# Altium schematic sheet SdpSchem.SchDoc
size A
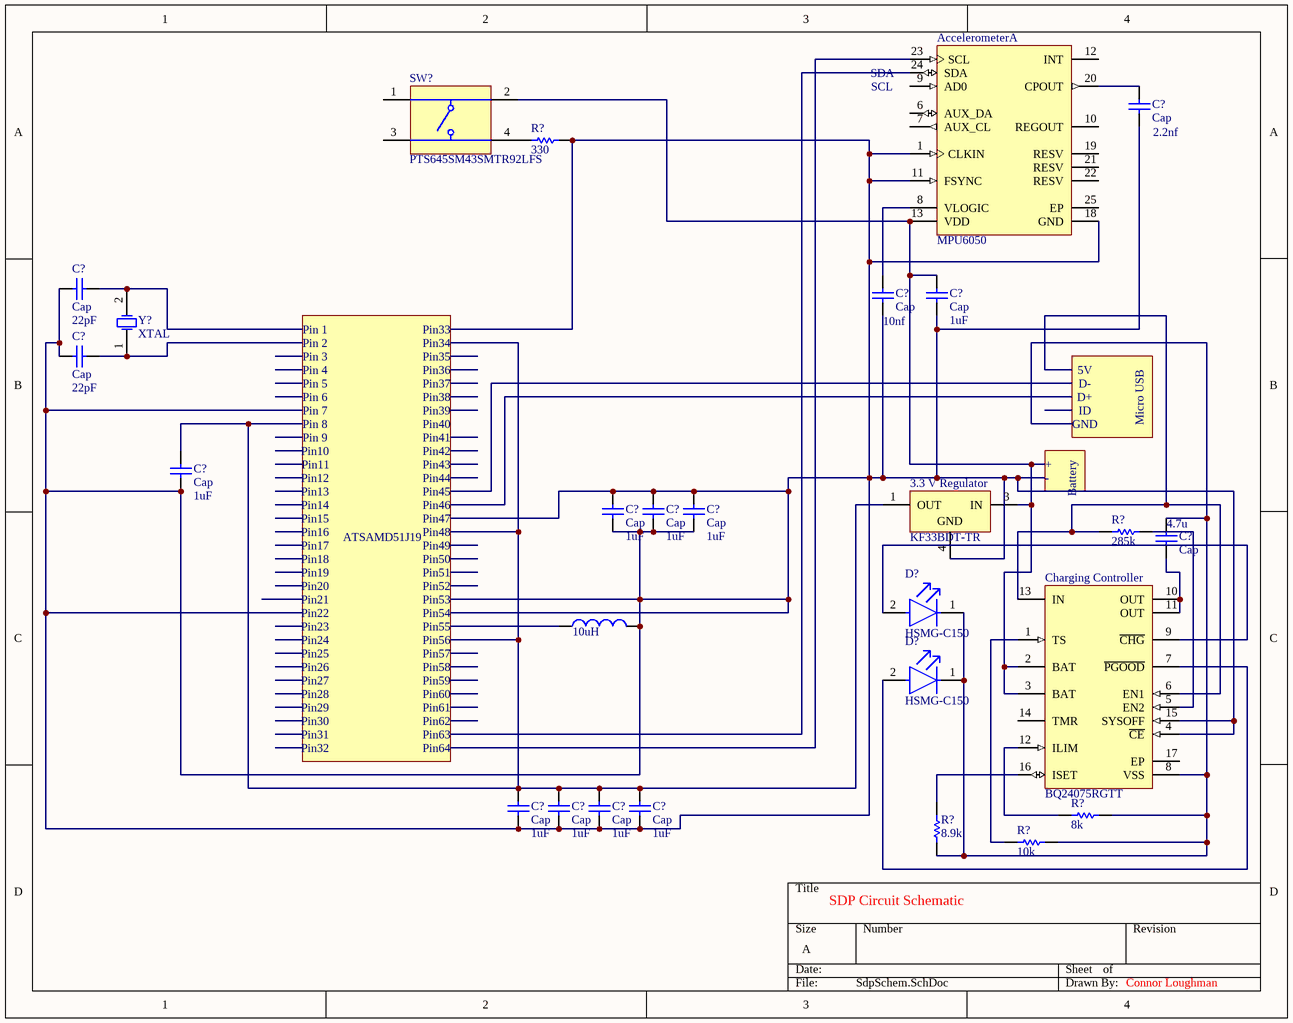
[diagram p0: SdpSchem.SchDoc]

## Parts
(Parts that share a designator on the sheet are numbered #1, #2 ... from top to bottom, then left to right.)
3.3_V_Regulator  KF33BDT-TR  [TO-252_L]
10uH  (no value)  [TDK-B82422A1103K100_V]
Accelerometer  MPU6050  [INSE-QFN-24_V]  (part A of 2)
C?#1  Cap  value 2.2nf  [RAD-0.3]
C?#2  Cap  value 22pF  [RAD-0.3]
C?#3  Cap  value 10nf  [RAD-0.3]
C?#4  Cap  value 1uF  [RAD-0.3]
C?#5  Cap  value 22pF  [RAD-0.3]
C?#6  Cap  value 1uF  [RAD-0.3]
C?#7  Cap  value 1uF  [RAD-0.3]
C?#8  Cap  value 1uF  [RAD-0.3]
C?#9  Cap  value 1uF  [RAD-0.3]
C?#10  Cap  value 4.7u  [RAD-0.3]
C?#11  Cap  value 1uF  [RAD-0.3]
C?#12  Cap  value 1uF  [RAD-0.3]
C?#13  Cap  value 1uF  [RAD-0.3]
C?#14  Cap  value 1uF  [RAD-0.3]
Charging_Controller  BQ24075RGTT  [RGT0016C_V]
D?#1  HSMG-C150  [FP-HSMG-C150-MFG]
D?#2  HSMG-C150  [FP-HSMG-C150-MFG]
R?#1  330  [AXIAL-0.3]
R?#2  285k  [AXIAL-0.3]
R?#3  8k  [AXIAL-0.3]
R?#4  10k  [AXIAL-0.3]
R?#5  8.9k  [AXIAL-0.3]
SW?  PTS645SM43SMTR92LFS  [ITT-PTS645S-4_V]
Y?  XTAL  [R38]

## Nets
Net3.3_V_Regulator_1: 3.3_V_Regulator.1(OUT) C?#6.2 C?#11.2 C?#12.2 C?#13.2 C?#14.2
Net3.3_V_Regulator_3: 3.3_V_Regulator.3(IN) Accelerometer.13(VDD) C?#4.2 Charging_Controller.2(BAT) Charging_Controller.3(BAT) SW?.2
Net3.3_V_Regulator_4: 3.3_V_Regulator.4(GND) 10uH.2 Accelerometer.1(CLKIN) Accelerometer.11(FSYNC) Accelerometer.18(GND) C?#1.1 C?#2.1 C?#3.1 C?#4.1 C?#5.1 C?#6.1 C?#7.1 C?#7.2 C?#8.1 C?#8.2 C?#9.1 C?#9.2 C?#11.1 C?#12.1 C?#13.1 C?#14.1 Charging_Controller.4(~{CE}) Charging_Controller.15(SYSOFF) R?#1.2
NetAccelerometer_8: Accelerometer.8(VLOGIC) C?#3.2
NetAccelerometer_20: Accelerometer.20(CPOUT) C?#1.2
NetC?#2_2: C?#2.2 Y?.2(OSC2)
NetC?#5_2: C?#5.2 Y?.1(OSC1)
NetC?#10_1: C?#10.1 Charging_Controller.10(OUT) Charging_Controller.11(OUT)
NetC?#10_2: C?#10.2 Charging_Controller.8(VSS) D?#1.1(C) D?#2.1(C) R?#3.2 R?#4.2 R?#5.1
NetCharging_Controller_1: Charging_Controller.1(TS) R?#4.1
NetCharging_Controller_5: Charging_Controller.5(EN2) R?#2.2
NetCharging_Controller_6: Charging_Controller.6(EN1) Charging_Controller.13(IN) R?#2.1
NetCharging_Controller_7: Charging_Controller.7(~{PGOOD}) D?#2.2(A)
NetCharging_Controller_9: Charging_Controller.9(~{CHG}) D?#1.2(A)
NetCharging_Controller_12: Charging_Controller.12(ILIM) R?#3.1
NetCharging_Controller_16: Charging_Controller.16(ISET) R?#5.2
NetR?#1_1: R?#1.1 SW?.4

Not connected (* = marked no-connect by the designer): 10uH 1; Accelerometer 6(AUX_DA) 7(AUX_CL) 9(AD0) 10(REGOUT) 12(INT) 19(RESV) 21(RESV) 22(RESV) 23(SCL) 24(SDA) 25(EP); Charging_Controller 14(TMR) 17(EP); SW? 1 3

## Notes on the sheet
- (near Accelerometer) SDA
- (near Accelerometer) SCL
- Pin 1
- Pin 2
- Pin 3
- Pin 4
- Pin33
- Pin34
- Pin35
- Pin36
- 5V
- Pin 5
- Pin 6
- Pin 7
- Pin 8
- Pin 9
- Pin37
- Pin38
- Pin39
- Pin40
- Pin41
- D-
- D+
- ID
- GND
- Micro USB
- Pin10
- Pin11
- Pin12
- Pin13
- Pin14
- Pin42
- Pin43
- Pin44
- Pin45
- Pin46
- +
- -
- Battery
- Pin15
- Pin16
- Pin18
- Pin19
- Pin17
- ATSAMD51J19
- Pin47
- Pin48
- Pin49
- Pin50
- Pin51
- Pin20
- Pin21
- Pin22
- Pin23
- Pin24
- Pin52
- Pin53
- Pin54
- Pin55
- Pin56
- Pin25
- Pin26
- Pin27
- Pin28
- Pin29
- Pin57
- Pin58
- Pin59
- Pin60
- Pin61
- Pin30
- Pin31
- Pin32
- Pin62
- Pin63
- Pin64
- (near R?#5) SDP Circuit Schematic
- Connor Loughman

## Library data of the parts
3.3_V_Regulator = CMP-0244-00072-1: Very Low Drop Voltage Regulators with Inhibit, 3.3V, 3-Pin DPAK, Tape and Reel; DatasheetVersion: 21/02/2008; ComponentLink2Description: Datasheet; ComponentLink1URL: http://www.st.com; PackageVersion: 2011; ComponentLink1Description: Manufacturer URL; PackageDescription: 3-Pin Transistor Outline Package 2.28 mm Pitch, 9.7 mm Lead Span (DPAK); ComponentLink2URL: http://www.st.com/internet/com/TECHNICAL_RESOURCES/TECHNICAL_LITERATURE/DATASHEET/CD00000970.pdf; PackageReference: TO-252
10uH = CMP-2000-05912-1: Wirewound Inductor, 10 uF, +/- 10%, 180 mA, -55 to 125 degC, 2-Pin SMD, RoHS, Tape and Reel; Manufacturer: EPCOS-(TDK); Frequency - Test: 1MHz; Current Rating: 180mA; Material - Core: Ferrite; Inductance: 10µH; DC Resistance (DCR): 1.6OhmMax; Q @ Freq: 27@2.52MHz; Frequency - Self Resonant: 25MHz; Shielding: Unshielded; Series: SIMID; Size / Dimension: 0.126"Lx0.098"W(3.20mmx2.50mm); Mounting Type: SurfaceMount; Current - Saturation: -; Operating Temperature: -; Datasheet URL: https://en.tdk.eu/inf/30/db/ind_2008/b82422a_100.pdf; Ratings: AEC-Q200; Category: Inductors,Coils,Chokes; Mounting Technology: SurfaceMount; Height - Seated (Max): 0.083"(2.10mm); Family: FixedInductors; Package / Case: 1210(3225Metric); Tolerance: ±10%; Manufacturer URL: http://www.tdk.com/; Datasheet Version: 10/2012; Type: Wirewound; Packaging: CutTape(CT); Package Description: 2-Pin Surface Mount Device, Body 3.2 x 2.5 mm; Package Reference: B82422A1103K100
Accelerometer = CMP-1753-00002-1: 3-Axis Gyroscope, 3-Axis Accelerometer / , 2.375 to 3.46 V, -40 to 105 degC, 24-Pin QFN, RoHS, Tape and Reel; Resistance: 5.6 kohm; Tolerance: 1%; Voltage Rating: 75 V; Power Rating: 100 mW; ComponentLink1Description: Manufacturer URL; Mount: Surface Mount; Max Operating Temperature: 155degC; Package Quantity: 5000; ComponentLink2Description: Datasheet; Pins: 2; Packaging: Tape and Reel; Case Code (Imperial): 0603; PackageReference: QFN-24; ComponentLink2URL: https://datasheet.ciiva.com/1513/1788002-1513632.pdf; Radiation Hardening: No; ComponentLink1URL: http://www.invensense.com/; PackageDescription: 24-Pin Quad Flat No-lead Package, Body 4 x 4 mm, Pitch 0.5 mm; Height: 0.45 mm; Case/Package: 0603; Case Code (Metric): 1608; REACH SVHC: Yes; Min Operating Temperature: -55degC; DatasheetVersion: Rev. 3.4, 08/2013; Width: 0.8 mm; RoHSCompliant: True; Length: 1.6 mm
C?#1-C?#14 = Cap: Capacitor; Published: 8-Jun-2000; LatestRevisionDate: 17-Jul-2002; LatestRevisionNote: Re-released for DXP Platform.; PackageReference: RAD-0.3; Publisher: Altium Limited; PackageDescription: Radial Cap, Thru-Hole; 2 Leads; 0.3 in Pin Spacing
Charging_Controller = CMP-0321-00236-2: USB-Friendly Li-Ion Battery Charger and Power-Path Management IC, Vout 5.5 V, 4.3 V, -40 to 85 degC, 16-pin QFN (RGT), Green (RoHS & no Sb/Br); Manufacturer: Texas Instruments; Vin(Min)(V): 4.3; SubFamily: Battery Charge Management; NiMH: N; PackageDescription: 16-Pin Plastic Quad Flat No-Lead, 3 x 3 mm Body, 0.5 mm Pitch, 1.7 x 1.7 mm Exposed Pad; PartNumber: BQ24075RGTT; PackageVersion: revH, Oct-2011; Eco-Plan: Green (RoHS & no Sb/Br); Code_JEDEC: MO-220; ComponentLink1Description: Datasheet; PackageReference: RGT0016C; NiCd: N; Li-Polymer: N; DatasheetVersion: SLUS810G; ComponentLink1URL: http://www.ti.com/general/docs/lit/getliterature.tsp?genericPartNumber=BQ24075&fileType=pdf; Over Voltage Protection: N; Mounting Technology: Surface Mount; Lead Acid: N; Li-Ion: N
D?#1 D?#2 = CMP-18399-000016-1: LED GREEN DIFFUSED 1206 SMD; Manufacturer: Broadcom; Led Orientation: Top View; Max Junction Temp: +95°C; Peak Emmision Wavelength: 570nm; Viewing Angle: 170°; Wavelength: 572nm; Reverse Voltage: 5V; Luminous Intensity: 15mcd; Forward Voltage: 2.2V; Power Dissipation: 65mW; Forward Current: 20mA; ComponentLink2Description: Datasheet; Lead Free: Yes; Temperature Range Low: -40°C; Package: HSMG-C150; Digikey Description: LED GREEN DIFFUSED 1206 SMD; Mouser Description: LED Uni-Color Green 570nm 2-Pin Chip LED T/R; Manufacturer Part Number: HSMG-C150; Temperature Range High: +85°C; Device Class L1: Optoelectronics; Colour: Green; Category: Diode; Device Class L3: unset; RoHS: TRUE; Height: 1.2mm; ComponentLink2URL: https://docs.broadcom.com/docs/AV02-0551EN; Device Class L2: LEDs; Automotive: No; Ipc Land Pattern Name: DIOCP320160X55; Octopart: https://octopart.com/hsmg-c150-broadcom-71131304; Temperature: -40°C to +85°C
R?#1-R?#5 = Res1: Resistor; Published: 8-Jun-2000; LatestRevisionDate: 17-Jul-2002; LatestRevisionNote: Re-released for DXP Platform.; PackageReference: AXIAL-0.3; Publisher: Altium Limited; PackageDescription: Axial Device, Thru-Hole; 2 Leads; 0.3 in Pin Spacing
SW? = CMP-2000-05160-1: 6 mm Tact Switche, SPST, NO, -20 to 60 degC, 4-Pin SMT, RoHS, Tape and Reel; Manufacturer: ITT Cannon; Manufacturer URL: http://www.ittcannon.com/; Datasheet Version: Feb-14; Datasheet URL: https://datasheet.ciiva.com/29903/getdatasheetpartid-786341-29903846.pdf
Y? = XTAL: Crystal Oscillator; Published: 8-Jun-2000; LatestRevisionDate: 17-Jul-2002; LatestRevisionNote: Re-released for DXP Platform.; PackageReference: R38; Publisher: Altium Limited; PackageDescription: Crystal, Thru-Hole; 2 Leads; Body 3.1 x 8.2 mm (Dia.xH)